# Altium project master.PrjPcb
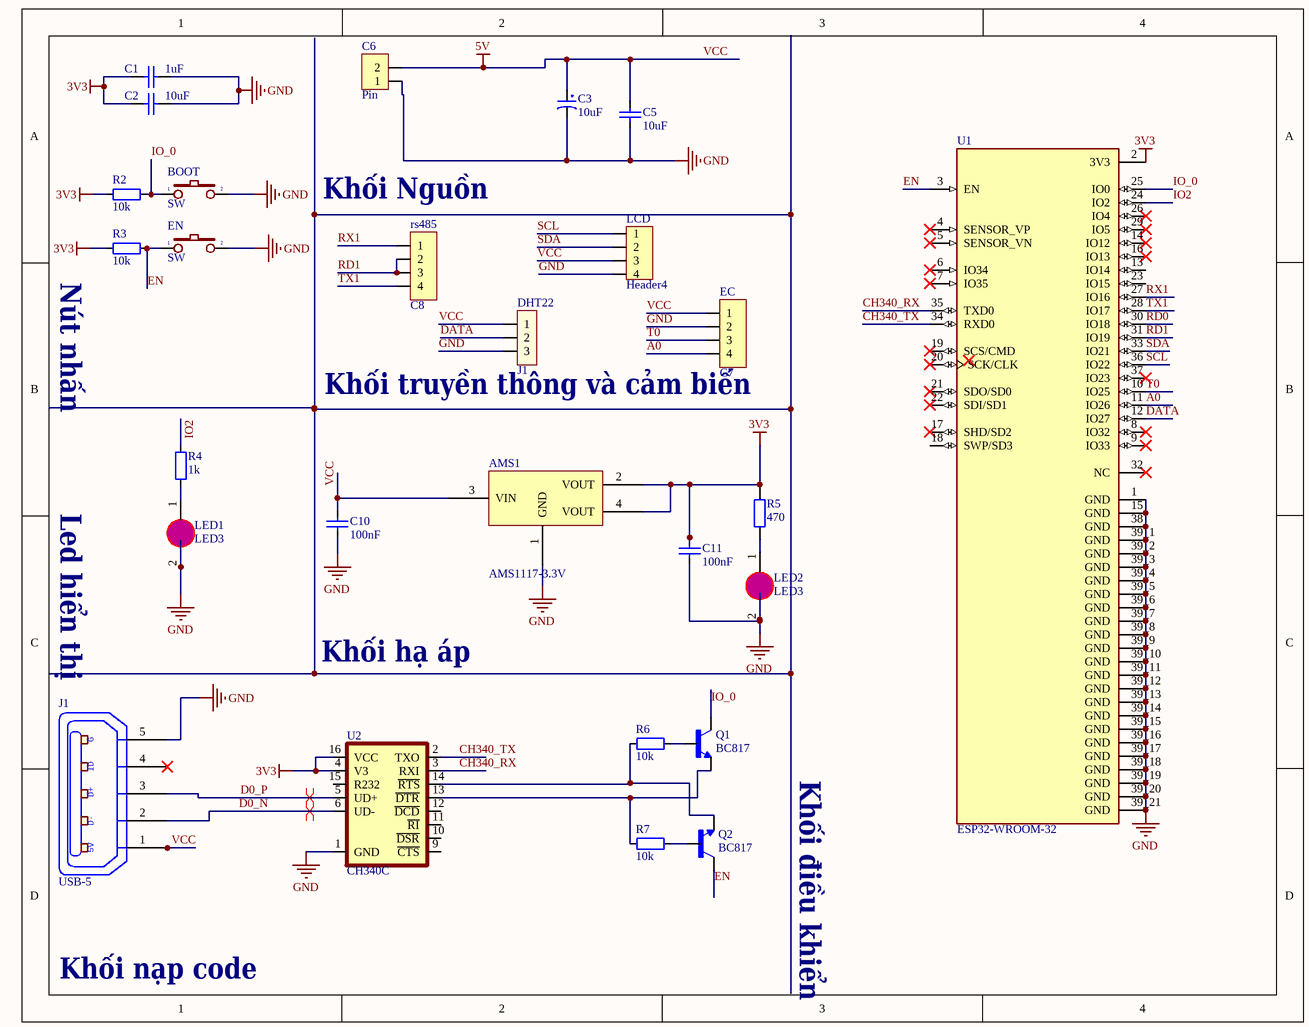
[diagram p0: mach master.SchDoc]
1 sheet, 27 parts. Net scope: global (net labels, ports and power ports of the same name join across sheets).
Board file: master.PcbDoc

## Sheet mach master.SchDoc
size A

### Parts
AMS1  AMS1117-3.3V  [SOT223]
BOOT  SW  [SW-SMD]
C1  1uF  [CAP_0805]
C2  10uF  [CAP_0805]
C3  10uF  [tu tantalum smd3216]
C5  10uF  [CAP_0805]
C6  Pin  [KF2-5.08]
C10  100nF  [CAP_0805]
C11  100nF  [CAP_0805]
DHT22  J1  [Header3]
EC  C7  [Header4]
EN  SW  [SW-SMD]
J1  USB-5  [USB-M1]
LCD  Header4  [Header4]
LED1  LED3  [LED0805]
LED2  LED3  [LED0805]
Q1  BC817  [SOT95P240X97-3N]
Q2  BC817  [SOT95P240X97-3N]
R2  10k  [RES-SMD-0805]
R3  10k  [RES-SMD-0805]
R4  1k  [RES-SMD-0805]
R5  470  [RES-SMD-0805]
R6  10k  [RES-SMD-0805]
R7  10k  [RES-SMD-0805]
rs485  C8  [Header4]
U1  ESP32-WROOM-32  [MODULE_ESP32-WROOM-32]
U2  CH340C  [SOP-16]

### Nets
3V3: AMS1.2(VOUT) AMS1.4(VOUT) C1.1 C2.1 C11.2 R2.2 R3.2 R5.1 U1.2(3V3) U2.4(V3) U2.16(VCC)
GND: AMS1.1(GND) BOOT.2 C1.2 C2.2 C3.2 C5.1 C6.1 C10.1 C11.1 DHT22.3 EC.2 EN.2 J1.5(P5) LCD.4 LED1.2(K) LED2.2(K) U1.1(GND) U1.15(GND) U1.38(GND) U1.39_1(GND) U1.39_2(GND) U1.39_3(GND) U1.39_4(GND) U1.39_5(GND) U1.39_6(GND) U1.39_7(GND) U1.39_8(GND) U1.39_9(GND) U1.39_10(GND) U1.39_11(GND) U1.39_12(GND) U1.39_13(GND) U1.39_14(GND) U1.39_15(GND) U1.39_16(GND) U1.39_17(GND) U1.39_18(GND) U1.39_19(GND) U1.39_20(GND) U1.39_21(GND) U2.1(GND)
VCC: AMS1.3(VIN) C3.1 C5.2 C6.2 C10.2 DHT22.1 EC.1 J1.1(P1) LCD.3  [also labelled 5V]
A0: EC.4 U1.11(IO26)
CH340_RX: U1.35(TXD0) U2.3(RXI)
CH340_TX: U1.34(RXD0) U2.2(TXO)
D0_N: J1.2(P2) U2.6(UD-)
D0_P: J1.3(P3) U2.5(UD+)
DATA: DHT22.2 U1.12(IO27)
EN: EN.1 Q2.3(C) R3.1 U1.3(EN)
IO2: R4.2 U1.24(IO2)
IO_0: BOOT.1 Q1.3(C) R2.1 U1.25(IO0)
RD0: U1.30(IO18)
RD1: rs485.2 rs485.3 U1.31(IO19)
RX1: rs485.1 U1.27(IO16)
SCL: LCD.1 U1.36(IO22)
SDA: LCD.2 U1.33(IO21)
T0: EC.3 U1.10(IO25)
TX1: rs485.4 U1.28(IO17)
NetLED1_1: LED1.1(A) R4.1
NetLED2_1: LED2.1(A) R5.2
NetQ1_1: Q1.1(B) R6.1
NetQ1_2: Q1.2(E) R7.2 U2.13(~{DTR})
NetQ2_1: Q2.1(B) R7.1
NetQ2_2: Q2.2(E) R6.2 U2.14(~{RTS})

Not connected (* = marked no-connect by the designer): J1 4(P4)*; U1 4(SENSOR_VP)* 5(SENSOR_VN)* 6(IO34)* 7(IO35)* 8(IO32)* 9(IO33)* 13(IO14) 14(IO12)* 16(IO13)* 17(SHD/SD2)* 18(SWP/SD3) 19(SCS/CMD)* 20(SCK/CLK)* 21(SDO/SD0)* 22(SDI/SD1)* 23(IO15) 26(IO4)* 29(IO5)* 32(NC)* 37(IO23)*; U2 9(~{CTS}) 10(~{DSR}) 11(~{RI}) 12(~{DCD}) 15(R232)

### Layout directives
differential pair: D0_N, D0_P

### Notes on the sheet
- (near rs485) Khối Nguồn
- (near R3) Nút nhấn
- Khối truyền thông và cảm biến
- Led hiển thị
- Khối hạ áp
- Khối điều khiển
- Khối nạp code
- (in symbol USB-5) G; ID; D+; D-; 5V

### Library data of the parts
AMS1 = AMS1117 SMD: Dán; Value: AMS1117-3.3V SOT223; Don_Vi: Con; Ma_Hang: MH000596; Ghi_Chu: *; Kieu_Chan: *; Chung_Loai: Dán
BOOT EN = SW2: Switch button 2 pin; Value: SW chip 2 pin
C1 C2 C5 C10 C11 = CapSMD: Capacitor; Value: 33p; Published: 8-Jun-2000; LatestRevisionDate: 17-Jul-2002; LatestRevisionNote: Re-released for DXP Platform.; PackageReference: RAD-0.3; Publisher: Altium Limited
C3 = Tu tantalum 10uF 16V SMD3216: Dán; Don_Vi: Con; So_Chan: 2; Ten_Linh_Kien: Tụ tantalum 106C-10uF 16V SMD3216; Ma_Hang: MH001954; Chung_Loai: Dán; Kieu_Chan: *
C6 = Header2: Header IDC, 2 x 1 Pin Vertical 2.54mm Pitch (Non-Boxed, Male); Manufacturer: W¨¹rth Elektronik eiSos GmbH; partNo: 613002143121; ComponentLink1 Description: Manufacturer; ComponentLink2 Description: Datasheet; NoPins: 02; Created Date: 29 March 2013; ComponentLink1URL: http://www.we-online.com; ComponentLink2URL: http://katalog.we-online.de/em/datasheet/6130xx143121.pdf; Created by: Karrer Zheng
DHT22 = JP3: Jumper 3; Value: J3
EC rs485 = JP4: WR-PHD 2.54 mm Angled Socket Header; Manufacturer: W¨¹rth Elektronik eiSos GmbH; partNo: 613004143121; ComponentLink1 Description: Manufacturer; ComponentLink2 Description: Datasheet; NoPins: 04; Created Date: 29 March 2013; ComponentLink1URL: http://www.we-online.com; ComponentLink2URL: http://katalog.we-online.de/em/datasheet/6130xx143121.pdf; Created by: Karrer Zheng
J1 = USB-5: Manufacturer: FCI; Manufacturer Part Number: 10118193-0001LF; Connector Type: USB - micro B; Number of Contacts: 5; Gender: Receptacle; Specifications: USB 2.0; .Creator: MM; .Checked PCB: RF; Supplier 1: Digi-Key; RoHS: RoHS Compliant; Category: Connectors, Interconnects; Stock 1: 28642; Pricing 1: 1=0.46, 10=0.433, 25=0.3712, 50=0.3156, 100=0.3032, 250=0.27224, 500=0.25988 (USD); Packaging: Cut Tape (CT); Mounting Type: Surface Mount, Right Angle, Horizontal; Features: Shielded, Solder Retention; Ingress Protection: -; ComponentLink1URL: http://portal.fciconnect.com/Comergent//fci/drawing/10118193.pdf; ComponentLink1Description: http://portal.fciconnect.com/Comergent//fci/drawing/10118193.pdf; Supplier Part Number 1: 609-4616-1-ND; .Checked SCH: MM
LCD = Header4: Header IDC, 4 x 1 Pin Vertical 2.54mm Pitch (Non-Boxed, Male); Manufacturer: W¨¹rth Elektronik eiSos GmbH; partNo: 613002143121; ComponentLink1 Description: Manufacturer; ComponentLink2 Description: Datasheet; NoPins: 02; Created Date: 29 March 2013; ComponentLink1URL: http://www.we-online.com; ComponentLink2URL: http://katalog.we-online.de/em/datasheet/6130xx143121.pdf; Created by: Karrer Zheng
LED1 LED2 = LED0805: LED SMD 0805
Q1 Q2 = BC817: Bipolar (BJT) Transistor NPN 45V 500mA 100MHz 250mW Surface Mount TO-236AB; MF: Rectron; MP: BC817; Value: *; SnapEDA_Link: https://www.snapeda.com/parts/BC817/Rectron/view-part/?ref=snap; Availability: In Stock; Purchase-URL: https://pricing.snapeda.com/search/part/BC817/?ref=eda; Package: SOT-23-3 Rectron; Price: None; Check_prices: https://www.snapeda.com/parts/BC817/Rectron/view-part/?ref=eda
R2-R4 R6 R7 = Resistor - SMD: Resistor; Manufacturer: Generic Components; Class: Passive; Published: 08/06/2000; Publisher: Altium Hobart Technology Centre
R5 = Resistor - SMD: 22; Manufacturer: Generic Components; Class: Passive; Published: 08/06/2000; Publisher: Altium Hobart Technology Centre
U1 = ESP32-WROOM-32: Bluetooth, WiFi 802.11b/g/n, Bluetooth v4.2 +EDR, Class 1, 2 and 3 Transceiver Module 2.4GHz ~ 2.5GHz Antenna Not Included, U.FL Surface Mount; MF: Espressif Systems; Price: None; Availability: In Stock; MP: ESP32-WROOM-32; Package: Module Espressif Systems; SnapEDA_Link: https://www.snapeda.com/parts/ESP32-WROOM-32/Espressif+Systems/view-part/?ref=snap; Check_prices: https://www.snapeda.com/parts/ESP32-WROOM-32/Espressif+Systems/view-part/?ref=eda; Value: *; Purchase-URL: https://pricing.snapeda.com/search/part/ESP32-WROOM-32/?ref=eda
U2 = CH340C: USB to serial chip CH340; MF: WCH; Package: Package; Check_prices: https://www.snapeda.com/parts/CH340C/WCH/view-part/5428851/?ref=eda; Value: *; Price: None; MP: CH340C; Availability: Unavailable; SnapEDA_Link: https://www.snapeda.com/parts/CH340C/WCH/view-part/5428851/?ref=snap